# Altium project ES2_ProximitySensor.PrjPcb
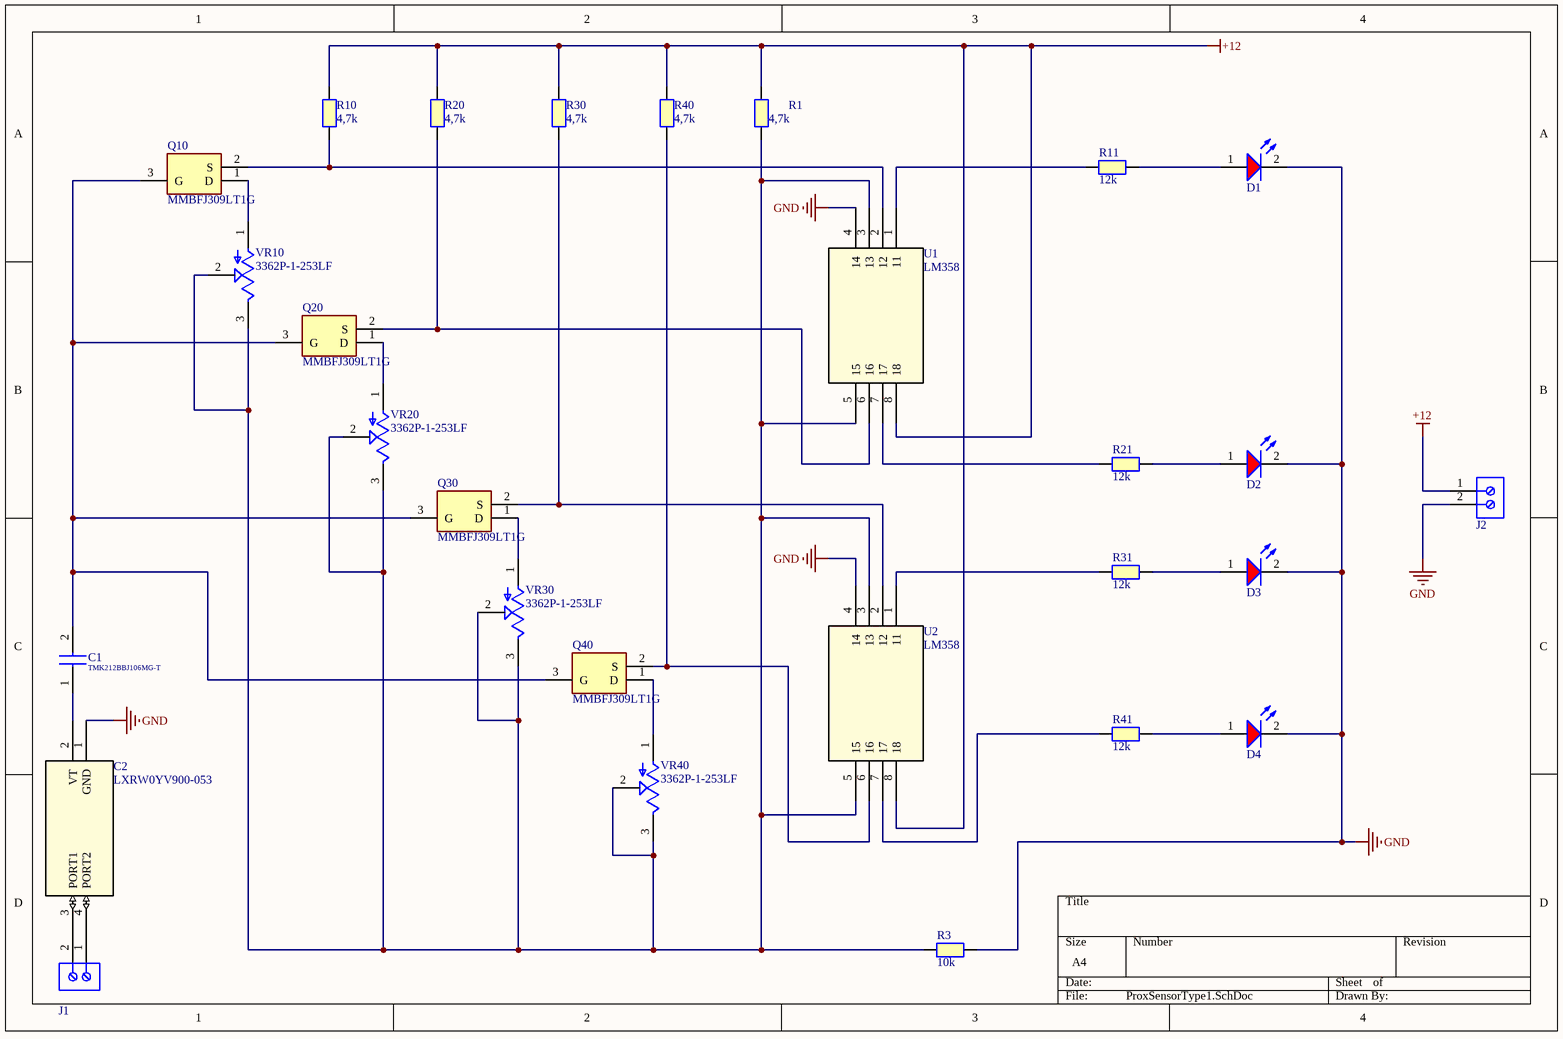
[diagram p0: ProxSensorType1.SchDoc]
3 sheets, 54 parts. Net scope: global (net labels, ports and power ports of the same name join across sheets).
Board files: ProxSensorType1.PcbDoc, ProxSensorType1_V2.PcbDoc, IRsense.PcbDoc
Sheets:
  ProxSensorType1.SchDoc
  ProxSensorType2_Transmit.SchDoc
  ProxSensorType2_Recieve.SchDoc

## Sheet ProxSensorType1.SchDoc
size A4; SheetNumber: 1; SheetTotal: 1

### Parts
C1  TMK212BBJ106MG-T  [CAPC2012X65N]
C2  LXRW0YV900-053  [LXRW-0Y_MUR-M]
D1  Super Red, 2.1V, 40°  [WL-TMRC_D5.9H8.7]  (value not drawn)
D2  Super Red, 2.1V, 40°  [WL-TMRC_D5.9H8.7]  (value not drawn)
D3  Super Red, 2.1V, 40°  [WL-TMRC_D5.9H8.7]  (value not drawn)
D4  Super Red, 2.1V, 40°  [WL-TMRC_D5.9H8.7]  (value not drawn)
J1  691210910002  [691210910002]  (value not drawn)
J2  691210910002  [691210910002]  (value not drawn)
Q10  MMBFJ309LT1G  [SOT96P237X111-3N]
Q20  MMBFJ309LT1G  [SOT96P237X111-3N]
Q30  MMBFJ309LT1G  [SOT96P237X111-3N]
Q40  MMBFJ309LT1G  [SOT96P237X111-3N]
R1  4,7k  [RESC2012X50N]
R3  10k  [RESC2012X50N]
R10  4,7k  [RESC2012X50N]
R11  12k  [RESC2012X50N]
R20  4,7k  [RESC2012X50N]
R21  12k  [RESC2012X50N]
R30  4,7k  [RESC2012X50N]
R31  12k  [RESC2012X50N]
R40  4,7k  [RESC2012X50N]
R41  12k  [RESC2012X50N]
U1  LM358  [DIP8_300]
U2  LM358  [DIP8_300]
VR10  3362P-1-253LF  [TRIM_3362P-1-253LF]
VR20  3362P-1-253LF  [TRIM_3362P-1-253LF]
VR30  3362P-1-253LF  [TRIM_3362P-1-253LF]
VR40  3362P-1-253LF  [TRIM_3362P-1-253LF]

### Nets
+12: J2.1 R1.2 R10.2 R20.2 R30.2 R40.2 U1.8(18) U2.8(18)
GND: C2.1(GND) D1.2(K) D2.2(K) D3.2(K) D4.2(K) J2.2 R3.1 U1.4(14) U2.4(14)
NetC1_1: C1.1 C2.2(VT)
NetC1_2: C1.2 Q10.3(G) Q20.3(G) Q30.3(G) Q40.3(G)
NetC2_3: C2.3(PORT1) J1.2
NetC2_4: C2.4(PORT2) J1.1
NetD1_1: D1.1(A) R11.1
NetD2_1: D2.1(A) R21.1
NetD3_1: D3.1(A) R31.1
NetD4_1: D4.1(A) R41.1
NetQ10_1: Q10.1(D) VR10.1(CCW)
NetQ10_2: Q10.2(S) R10.1 U1.2(12)
NetQ20_1: Q20.1(D) VR20.1(CCW)
NetQ20_2: Q20.2(S) R20.1 U1.6(16)
NetQ30_1: Q30.1(D) VR30.1(CCW)
NetQ30_2: Q30.2(S) R30.1 U2.2(12)
NetQ40_1: Q40.1(D) VR40.1(CCW)
NetQ40_2: Q40.2(S) R40.1 U2.6(16)
NetR1_1: R1.1 R3.2 U1.3(13) U1.5(15) U2.3(13) U2.5(15) VR10.2(WIPER) VR10.3(CW) VR20.2(WIPER) VR20.3(CW) VR30.2(WIPER) VR30.3(CW) VR40.2(WIPER) VR40.3(CW)
NetR11_2: R11.2 U1.1(11)
NetR21_2: R21.2 U1.7(17)
NetR31_2: R31.2 U2.1(11)
NetR41_2: R41.2 U2.7(17)

### Library data of the parts
C1 = TMK212BBJ106MG-T: Capacitor; Manufacturer_Name: TAIYO YUDEN; Datasheet Link: https://ds.yuden.co.jp/TYCOMPAS/ut/download?pn=LMK063BBJ474MPLF&fileType=CA; Height: 1.45mm; Manufacturer_Part_Number: TMK212BBJ106MG-T; Mouser Part Number: 963-TMK212BBJ106MG-T; Mouser Price/Stock: https://www.mouser.co.uk/ProductDetail/Taiyo-Yuden/TMK212BBJ106MG-T?qs=lkMpTOwszhd%2F%252Bg1AlFV9dw%3D%3D
C2 = LXRW0YV900-053: Cap trimmer (variable capacitor); Mfr_Name: Murata; Type: DEV; Copyright: Copyright (C) 2023 Ultra Librarian. All rights reserved.; Manufacturer_Part_Number: LXRW0YV900-053; Digi-Key_Part_Number_1: 490-18380-2-ND; Digi-Key_Part_Number_2: 490-18380-1-ND; Digi-Key_Part_Number_3: 490-18380-6-ND; RefDes: RefDes
D1-D4 = LED_151051SS04000: WL-TMRC Mono-color Round Color, THT, D5.9 x H8.7mm, Super Red, 2.1V, 40°; Manufacturer: Wurth Elektronik; Case/Size Code: 5mm; Chip Technology: AlInGaP; Dominant Wavelength: 635nm; Luminous Intensity: 250mcd; Peak Wavelength: 640nm; Manufacturer Part Number: 151051SS04000; Category: Signal LEDs; Match Code: WL-TMRC; ComponentLink1Description: Website Link; ComponentLink1URL: https://www.we-online.com/redexpert/article/151051SS04000?ad; ComponentLink2Description: Datasheet Link; ComponentLink2URL: https://www.we-online.com/redexpert/spec/151051SS04000?ad; Mount: Through Hole; Operating Temperature Max: 85°C; Operating Temperature Min: -40°C; Packaging: Bulk; Height: 8.7mm; Diameter: 5.9mm; Emitting Color: Super Red; Forward Voltage: 2.1V; Viewing Angle: 40°
J1 J2 = 691210910002: WR-TBL Series 2109 Horizontal Entry, THT, pitch 2.54mm, 2p; Manufacturer: Wurth Elektronik; Modularity: No; Rated Current: 6A; Working Voltage: 150V; ComponentLink1Description: Website Link; ComponentLink1URL: https://www.we-online.com/redexpert/article/691210910002?ad; ComponentLink2Description: Datasheet Link; ComponentLink2URL: https://www.we-online.com/redexpert/spec/691210910002?ad; Manufacturer Part Number: 691210910002; Category: Terminal Blocks; Match Code: WR-TBL; Mount: Through Hole; Operating Temperature Max: 105°C; Operating Temperature Min: -40°C; Packaging: Box; Application: Rising Cage Clamp; Number of Pins: 2; Number of Rows: 1; Orientation: Horizontal; Pitch: 2.54mm
Q10 Q20 Q30 Q40 = MMBFJ309LT1G: Transistor; Manufacturer_Name: onsemi; Datasheet Link: http://www.onsemi.com/pub/Collateral/MMBFJ309LT1-D.PDF; Height: 1.11mm; Manufacturer_Part_Number: MMBFJ309LT1G; Mouser Part Number: 863-MMBFJ309LT1G; Mouser Price/Stock: https://www.mouser.co.uk/ProductDetail/onsemi/MMBFJ309LT1G?qs=HVbQlW5zcXXpftXEfcBAsg%3D%3D; Arrow Part Number: MMBFJ309LT1G; Arrow Price/Stock: https://www.arrow.com/en/products/mmbfj309lt1g/on-semiconductor
R1 R10 R20 R30 R40 = RESISTOR 0805: 4,7k Resistor 0805; Part Number: TNPW080510K0BETA; Manufacturer: Vishay Dale
R3 = RESISTOR 0805: 10k Resistor 0805; Part Number: TNPW080510K0BETA; Manufacturer: Vishay Dale
R11 R21 R31 R41 = RESISTOR 0805: 12k Resistor 0805; Part Number: TNPW080510K0BETA; Manufacturer: Vishay Dale
U1 U2 = LM358: Texas instruments LM358 opamp; Copyright: Copyright (C) 2023 Ultra Librarian. All rights reserved.; Mfr_Name: Texas Instruments; Manufacturer_Part_Number: LM358; RefDes: RefDes; Type: DEV
VR10 VR20 VR30 VR40 = 3362P-1-253LF: 25 kOhms 0.5W, 1/2W PC Pins Through Hole Trimmer Potentiometer Cermet 1 Turn Top Adjustment; MF: Bourns; Check_prices: https://www.snapeda.com/parts/3362P-1-253LF/Bourns/view-part/493663/?ref=eda; SnapEDA_Link: https://www.snapeda.com/parts/3362P-1-253LF/Bourns/view-part/493663/?ref=snap; Availability: Good; Value: *; Purchase-URL: https://pricing.snapeda.com/search/part/3362P-1-253LF/?ref=eda; Price: None; MP: 3362P-1-253LF; Package: 3116 Bourns

## Sheet ProxSensorType2_Transmit.SchDoc
size A4; SheetNumber: 2; SheetTotal: 3
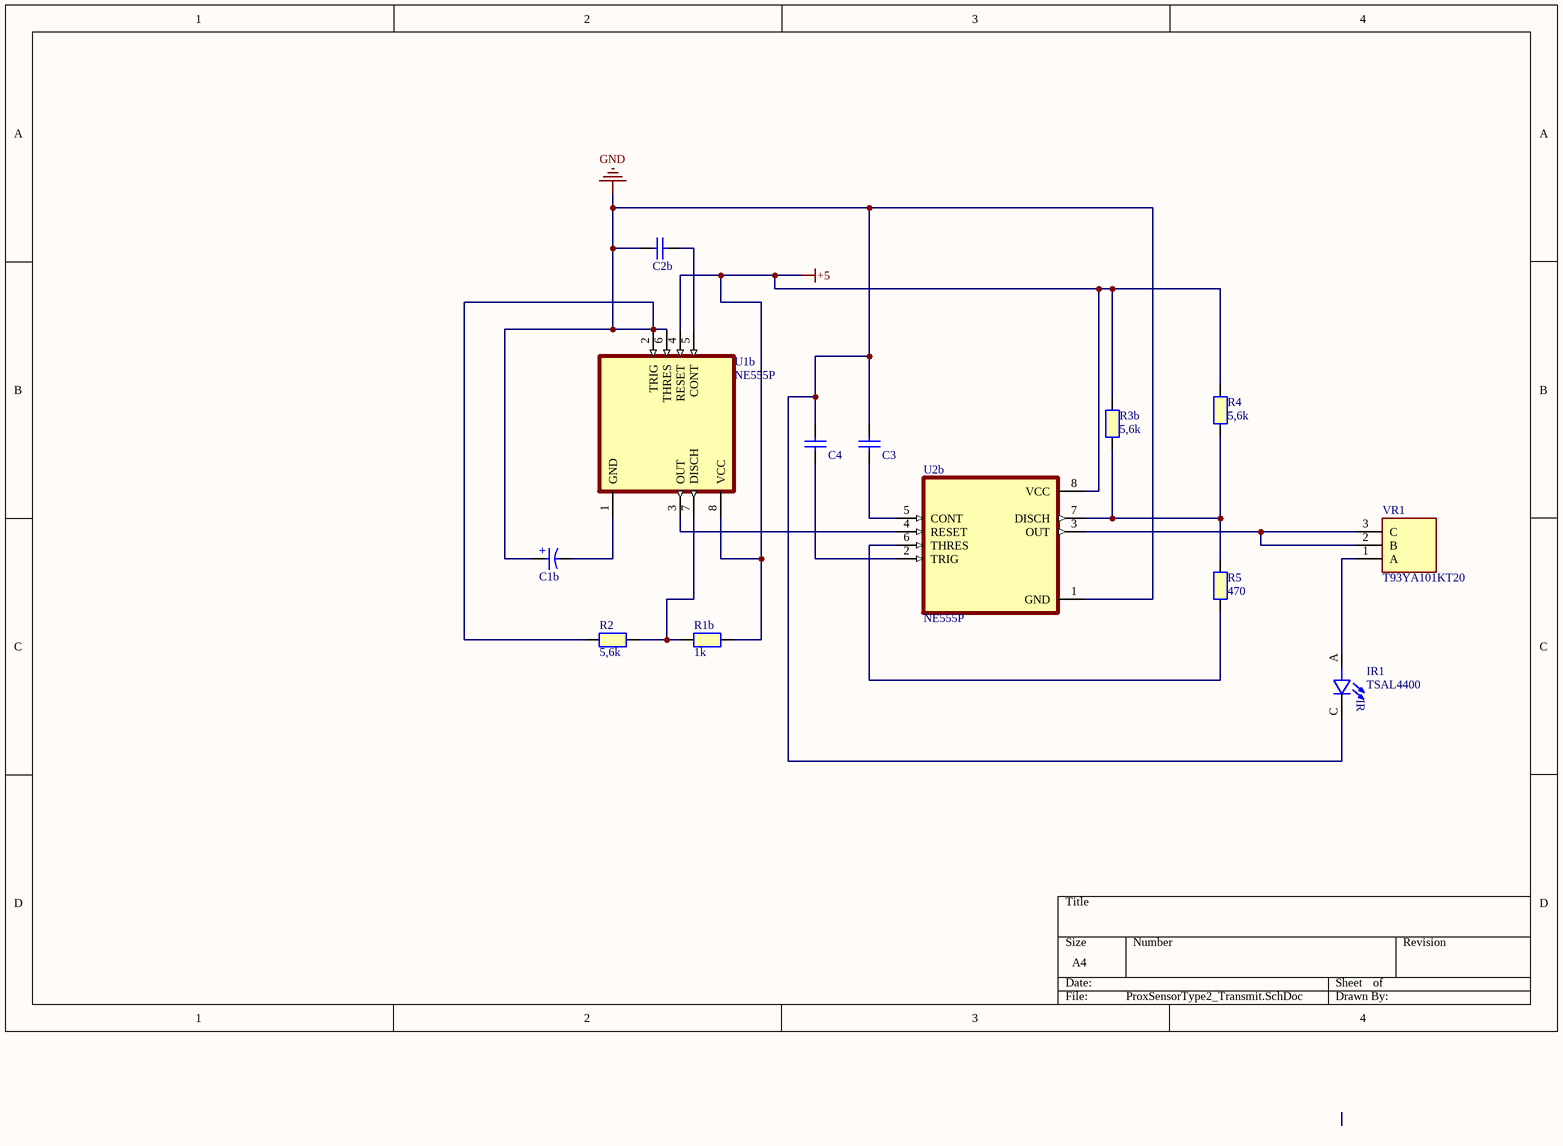
[diagram p1: ProxSensorType2_Transmit.SchDoc]

### Parts
C1b  1µF  [WCAP-ATG8_D5H11]  (value not drawn)
C2b  0,01uF  [WCAP-CSGP_0805_L2W1.25H0.8_Wave]  (value not drawn)
C3  0,01uF  [WCAP-CSGP_0805_L2W1.25H0.8_Wave]  (value not drawn)
C4  0,01uF  [WCAP-CSGP_0805_L2W1.25H0.8_Wave]  (value not drawn)
IR1  TSAL4400  [LEDRD254W45D335H610]
R1b  1k  [RESC2012X50N]
R2  5,6k  [RESC2012X50N]
R3b  5,6k  [RESC2012X50N]
R4  5,6k  [RESC2012X50N]
R5  470  [RESC2012X50N]
U1b  NE555P  [DIP794W45P254L959H508Q8]
U2b  NE555P  [DIP794W45P254L959H508Q8]
VR1  T93YA101KT20  [T93YA5K10]

### Nets
+5: R1b.2 R3b.2 R4.2 U1b.4(RESET) U1b.8(VCC) U2b.8(VCC)
GND: C1b.1(P) C2b.1 C3.2 C4.2 IR1.C R2.1 U1b.2(TRIG) U1b.6(THRES) U2b.1(GND)
NetC1b_2: C1b.2(N) U1b.1(GND)
NetC2b_2: C2b.2 U1b.5(CONT)
NetC3_1: C3.1 U2b.5(CONT)
NetC4_1: C4.1 U2b.2(TRIG)
NetIR1_A: IR1.A VR1.1(A)
NetR1b_1: R1b.1 R2.2 U1b.7(DISCH)
NetR3b_1: R3b.1 R4.1 R5.2 U2b.7(DISCH)
NetR5_1: R5.1 U2b.6(THRES)
NetU1b_3: U1b.3(OUT) U2b.4(RESET)
NetU2b_3: U2b.3(OUT) VR1.2(B) VR1.3(C)

### Notes on the sheet
- (in symbol 860010272005) +
- (in symbol TSAL4400) IR

### Library data of the parts
C1b = 860010272005: WCAP-ATG8 Aluminum Electrolytic Capacitor, Radial, THT, D5 x H11mm, 100µF, 10V; Manufacturer: Wurth Elektronik; Capacitance Tolerance: +/-20%; Dissipation Factor: 19%; Endurance: 2000h; Leakage Current: 10µA; Ripple Current: 198mA; Technical Reference: ATBC110101M010DSPA3B000; Manufacturer Part Number: 860010272005; Category: Aluminum Electrolytic Capacitors; Match Code: WCAP-ATG8; ComponentLink1Description: Website Link; ComponentLink1URL: https://www.we-online.com/redexpert/article/860010272005?ad; ComponentLink2Description: Datasheet Link; ComponentLink2URL: https://www.we-online.com/redexpert/spec/860010272005?ad; Mount: Through Hole; Operating Temperature Max: 85°C; Operating Temperature Min: -40°C; Packaging: Ammo Pack; Height: 11mm; Diameter: 5mm; Capacitance: 100µF; Rated Voltage (DC): 10V
C2b C3 C4 = 885012004008: WCAP-CSGP Multilayer Ceramic Chip Capacitor, General Purpose, size 0201, NP0 Class I, 22pF, 25VDC; Manufacturer: Wurth Elektronik; Case/Size Code: 0201; Capacitance Tolerance: +/-5%; Insulation Resistance: 10GΩ; Q Factor: 840; Rated Voltage (DC): 25V; Technical Reference: NP00201220J025DFCT10000; Manufacturer Part Number: 885012004008; Category: Multilayer Ceramic Chip Capacitors; Match Code: WCAP-CSGP; ComponentLink1Description: Website Link; ComponentLink1URL: https://www.we-online.com/redexpert/article/885012004008?ad; ComponentLink2Description: Datasheet Link; ComponentLink2URL: https://www.we-online.com/redexpert/spec/885012004008?ad; Mount: Surface Mount; Operating Temperature Max: 125°C; Operating Temperature Min: -55°C; Packaging: Tape and Reel; Length: 0.6mm; Width: 0.3mm; Height: 0.3mm; Capacitance: 22pF; Ceramic Type: NP0 Class I
IR1 = TSAL4400: Infrared Emitter 940nm 36mW/sr Circular Top Mount 2-Pin T-1 Bulk; MF: Vishay Semiconductor; Package: Radial Vishay; Price: None; SnapEDA_Link: https://www.snapeda.com/parts/TSAL4400/Vishay%20Semiconductor%20Opto%20Division/view-part/3623381/?ref=snap; Value: *; MP: TSAL4400; Availability: Unavailable
R1b R2 R3b R4 R5 = RESISTOR 0805: as R1 on sheet ProxSensorType1
VR1 = T93YA101KT20: 100, Through Hole Trimmer Potentiometer 0.5W Top Adjust Vishay, T93; Geometry.Height: 9mm; Mouser Part Number: 72-T93YA-100; Mouser Price/Stock: https://www.mouser.co.uk/ProductDetail/Vishay-Sfernice/T93YA101KT20?qs=iVq8I%252Bwveq19HOEubYKU9A%3D%3D; Manufacturer_Name: Vishay; Manufacturer_Part_Number: T93YA101KT20; Datasheet Link: https://www.vishay.com/docs/51026/t93.pdf
U1b U2b = NE555P: Package: None; Price: None; Value: *; MP: NE555P; Availability: Unavailable

## Sheet ProxSensorType2_Recieve.SchDoc
size A4; SheetNumber: 3; SheetTotal: 3
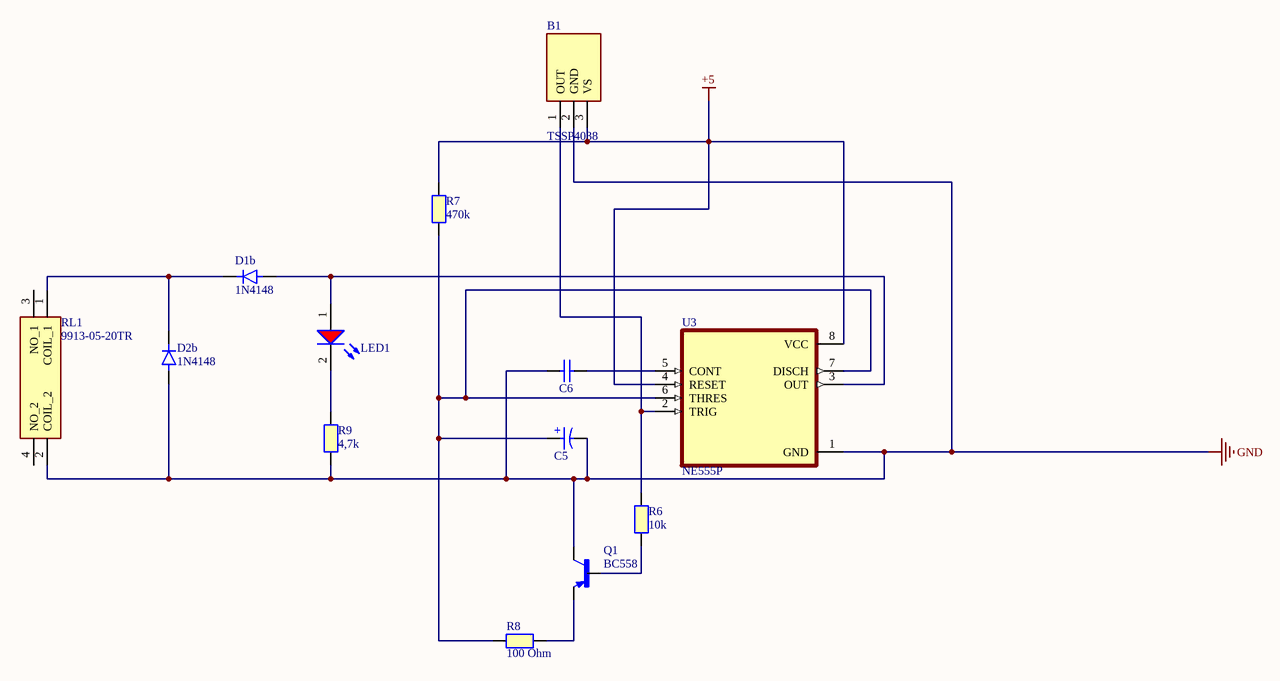
[diagram p2: ProxSensorType2_Recieve.SchDoc]

### Parts
B1  TSSP4038  [TSSP4038]
C5  4,7µF  [WCAP-ATG8_D5H11]  (value not drawn)
C6  0,01uF  [WCAP-CSGP_0805_L2W1.25H0.8_Wave]  (value not drawn)
D1b  1N4148  [DIOAD829W49L456D191]
D2b  1N4148  [DIOAD829W49L456D191]
LED1  Super Red, 2.1V, 40°  [WL-TMRC_D5.9H8.7]  (value not drawn)
Q1  BC558
R6  10k  [RESC2012X50N]
R7  470k  [RESC2012X50N]
R8  100 Ohm  [RESC2012X50N]
R9  4,7k  [RESC2012X50N]
RL1  9913-05-20TR  [99130520TR]
U3  NE555P  [DIP794W45P254L959H508Q8]

### Nets
+5: B1.3(VS) R7.2 U3.4(RESET) U3.8(VCC)
GND: B1.2(GND) C5.2(N) C6.1 D2b.A Q1.1(C) R9.1 RL1.2(COIL_2) U3.1(GND)
NetB1_1: B1.1(OUT) R6.2 U3.2(TRIG)
NetC5_1: C5.1(P) R7.1 R8.1 U3.6(THRES) U3.7(DISCH)
NetC6_2: C6.2 U3.5(CONT)
NetD1b_A: D1b.A LED1.1(A) U3.3(OUT)
NetD1b_C: D1b.C D2b.C RL1.1(COIL_1)
NetLED1_2: LED1.2(K) R9.2
NetQ1_2: Q1.2(B) R6.1
NetQ1_3: Q1.3(E) R8.2

Not connected (* = marked no-connect by the designer): RL1 3(NO_1) 4(NO_2)

### Notes on the sheet
- (in symbol 860010272005) +

### Library data of the parts
B1 = TSSP4038: IR Receiver Module 38KHz 25m EMI 3-Pin Vishay TSSP4038, 38kHz IR Receiver, 950nm +/-45 , 25m Range, 2.5V - 5V, Through Hole, 6 x 3.9 x 6.95mm; Mouser Part Number: 782-TSSP4038; Mouser Price/Stock: https://www.mouser.co.uk/ProductDetail/Vishay-Semiconductors/TSSP4038?qs=lgjwDzixuo3Ja5hn%252BEmOdw%3D%3D; Manufacturer_Name: Vishay; Manufacturer_Part_Number: TSSP4038; Datasheet Link: https://componentsearchengine.com/Datasheets/2/TSSP4038.pdf
C5 = 860010272005: as C1b on sheet ProxSensorType2_Transmit; Manufacturer Part Number: 860010272005; Category: Aluminum Electrolytic Capacitors; Match Code: WCAP-ATG8; ComponentLink1Description: Website Link; ComponentLink1URL: https://www.we-online.com/redexpert/article/860010272005?ad; ComponentLink2Description: Datasheet Link; ComponentLink2URL: https://www.we-online.com/redexpert/spec/860010272005?ad; Mount: Through Hole; Operating Temperature Max: 85°C; Operating Temperature Min: -40°C; Packaging: Ammo Pack; Height: 11mm; Diameter: 5mm; Capacitance: 100µF; Rated Voltage (DC): 10V
C6 = 885012004008: as C2b on sheet ProxSensorType2_Transmit; Manufacturer Part Number: 885012004008; Category: Multilayer Ceramic Chip Capacitors; Match Code: WCAP-CSGP; ComponentLink1Description: Website Link; ComponentLink1URL: https://www.we-online.com/redexpert/article/885012004008?ad; ComponentLink2Description: Datasheet Link; ComponentLink2URL: https://www.we-online.com/redexpert/spec/885012004008?ad; Mount: Surface Mount; Operating Temperature Max: 125°C; Operating Temperature Min: -55°C; Packaging: Tape and Reel; Length: 0.6mm; Width: 0.3mm; Height: 0.3mm; Capacitance: 22pF; Ceramic Type: NP0 Class I
D1b D2b = 1N4148: Diode Standard 75V 200mA Surface Mount SOD-523F; MF: ON Semiconductor; Price: None; Availability: In Stock; Package: AXIAL LEAD-2 ON Semiconductor; MP: 1N4148; Value: *; SnapEDA_Link: https://www.snapeda.com/parts/1N4148/Onsemi/view-part/?ref=snap; Purchase-URL: https://pricing.snapeda.com/search/part/1N4148/?ref=eda; Check_prices: https://www.snapeda.com/parts/1N4148/Onsemi/view-part/?ref=eda
LED1 = LED_151051SS04000: as D1 on sheet ProxSensorType1; Manufacturer Part Number: 151051SS04000; Category: Signal LEDs; Match Code: WL-TMRC; ComponentLink1Description: Website Link; ComponentLink1URL: https://www.we-online.com/redexpert/article/151051SS04000?ad; ComponentLink2Description: Datasheet Link; ComponentLink2URL: https://www.we-online.com/redexpert/spec/151051SS04000?ad; Mount: Through Hole; Operating Temperature Max: 85°C; Operating Temperature Min: -40°C; Packaging: Bulk; Height: 8.7mm; Diameter: 5.9mm; Emitting Color: Super Red; Forward Voltage: 2.1V; Viewing Angle: 40°
Q1 = BC558: Bipolar (BJT) Transistor PNP 30 V 100 mA 360MHz 625 mW Through Hole TO-92 (TO-226); MF: ON; Price: None; Availability: In Stock; MP: BC558; Package: TO-226-3 Diotec Semiconductor; SnapEDA_Link: https://www.snapeda.com/parts/BC558/Onsemi/view-part/?ref=snap; Check_prices: https://www.snapeda.com/parts/BC558/Onsemi/view-part/?ref=eda; Value: *; Purchase-URL: https://pricing.snapeda.com/search/part/BC558/?ref=eda
R6-R9 = RESISTOR 0805: as R1 on sheet ProxSensorType1
RL1 = 9913-05-20TR: RELAY STANDARD REED, 5V, 200 OHMS, J FORM, TR. / TAPE-REEL; Manufacturer_Name: Coto Technology; Geometry.Height: 3.61mm; Mouser Part Number: 816-9913-05-20TR; Mouser Price/Stock: https://www.mouser.co.uk/ProductDetail/Coto-Technology/9913-05-20TR?qs=BJlw7L4Cy7%2Ft0vFUsUT%2FEw%3D%3D; Manufacturer_Part_Number: 9913-05-20TR; Datasheet Link: https://componentsearchengine.com/Datasheets/1/9913-05-20TR.pdf
U3 = NE555P: Package: None; Price: None; Value: *; MP: NE555P; Availability: Unavailable

## Nets that join several sheets
+5: ProxSensorType2_Transmit (6 pins), ProxSensorType2_Recieve (B1.3 R7.2 U3.4 U3.8)
GND: ProxSensorType1 (9 pins), ProxSensorType2_Transmit (9 pins), ProxSensorType2_Recieve (8 pins)